# Altium schematic sheet POWERAMP2.SchDoc
size A
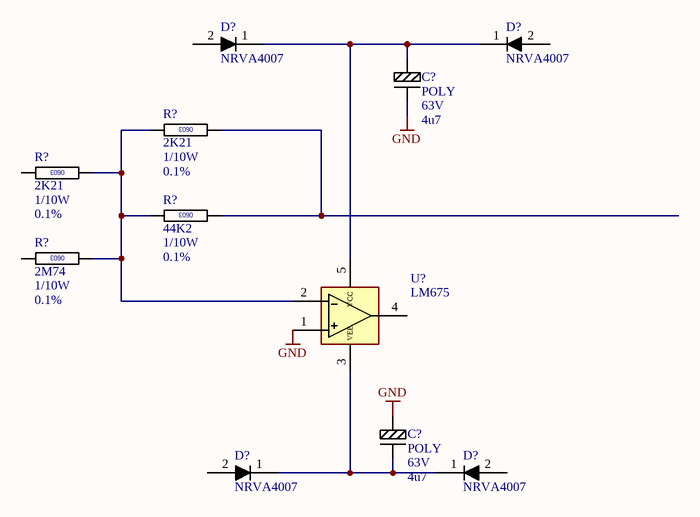
[diagram p0: POWERAMP2.SchDoc]

## Parts
(Parts that share a designator on the sheet are numbered #1, #2 ... from top to bottom, then left to right.)
C?#1  Dielectric: POLY  Voltage: 63V  Capacitance: 4u7  [CAPC0603]  (hidden comment: CAPP)
C?#2  Dielectric: POLY  Voltage: 63V  Capacitance: 4u7  [CAPC0603]  (hidden comment: CAPP)
D?#1  NRVA4007
D?#2  NRVA4007
D?#3  NRVA4007
D?#4  NRVA4007
R?#1  value 2K21  Power: 1/10W  Tolerance: 0.1%  [RESC0603]  (hidden comment: RESC0603)
R?#2  value 2K21  Power: 1/10W  Tolerance: 0.1%  [RESC0603]  (hidden comment: RESC0603)
R?#3  value 44K2  Power: 1/10W  Tolerance: 0.1%  [RESC0603]  (hidden comment: RESC0603)
R?#4  value 2M74  Power: 1/10W  Tolerance: 0.1%  [RESC0603]  (hidden comment: RESC0603)
U?  LM675

## Nets
GND: C?#1.2 C?#2.1 U?.1(+)
NetC?#1_1: C?#1.1 D?#1.1(K) D?#2.1(K) U?.5(VCC)
NetC?#2_2: C?#2.2 D?#3.1(K) D?#4.1(K) U?.3(VEE)
NetR?#1_1: R?#1.1 R?#2.2 R?#3.1 R?#4.2 U?.2(-)
NetR?#1_2: R?#1.2 R?#3.2

Not connected (* = marked no-connect by the designer): D?#1 2(A); D?#2 2(A); D?#3 2(A); D?#4 2(A); R?#2 1; R?#4 1; U? 4(OUT)

## Notes on the sheet
- (in symbol RESC-0603-2K21-0.1%-1/10W) 0603
- (in symbol RESC-0603-2M74-0.1%-1/10W) 0603
- (in symbol RESC-0603-44K2-0.1%-1/10W) 0603

## Library data of the parts
C?#1 C?#2 = CAPP-0603-4u7-63V-POLY: CAPACITOR,POLYMER,4u7,63V; Manufacturer 1: PANASONIC; Manufacturer Part Number 1: EEHZC1H101P; Package / Case: CAPP100D102H; Location: *; LCSC: C161937
D?#1-D?#4 = DIODE-ONSEMI-NRVA4007T3G: DIODE,RECTIFIER,1000V,1A,ONSEMI,NRVA4007,SMA; DIGIKEY: NRVA4007T3GOSCT-ND; Manufacturer 1: ONSEMI; Manufacturer Part Number 1: NRVA4007T3G
R?#1 R?#2 = RESC-0603-2K21-0.1%-1/10W: RESISTOR,2K21,0.1%,100mW,0603 (1608); Location: *
R?#3 = RESC-0603-44K2-0.1%-1/10W: RESISTOR,44K2,0.1%,100mW,0603 (1608); Location: *
R?#4 = RESC-0603-2M74-0.1%-1/10W: RESISTOR,2M74,0.1%,100mW,0603 (1608); Location: *
U? = IC-TI-LM675-TO220-5: IC,OPAMP,SINGLE,POWER,LM675,TO220-5